# EAGLE schematic controlnode (EAGLE 6.5.0)
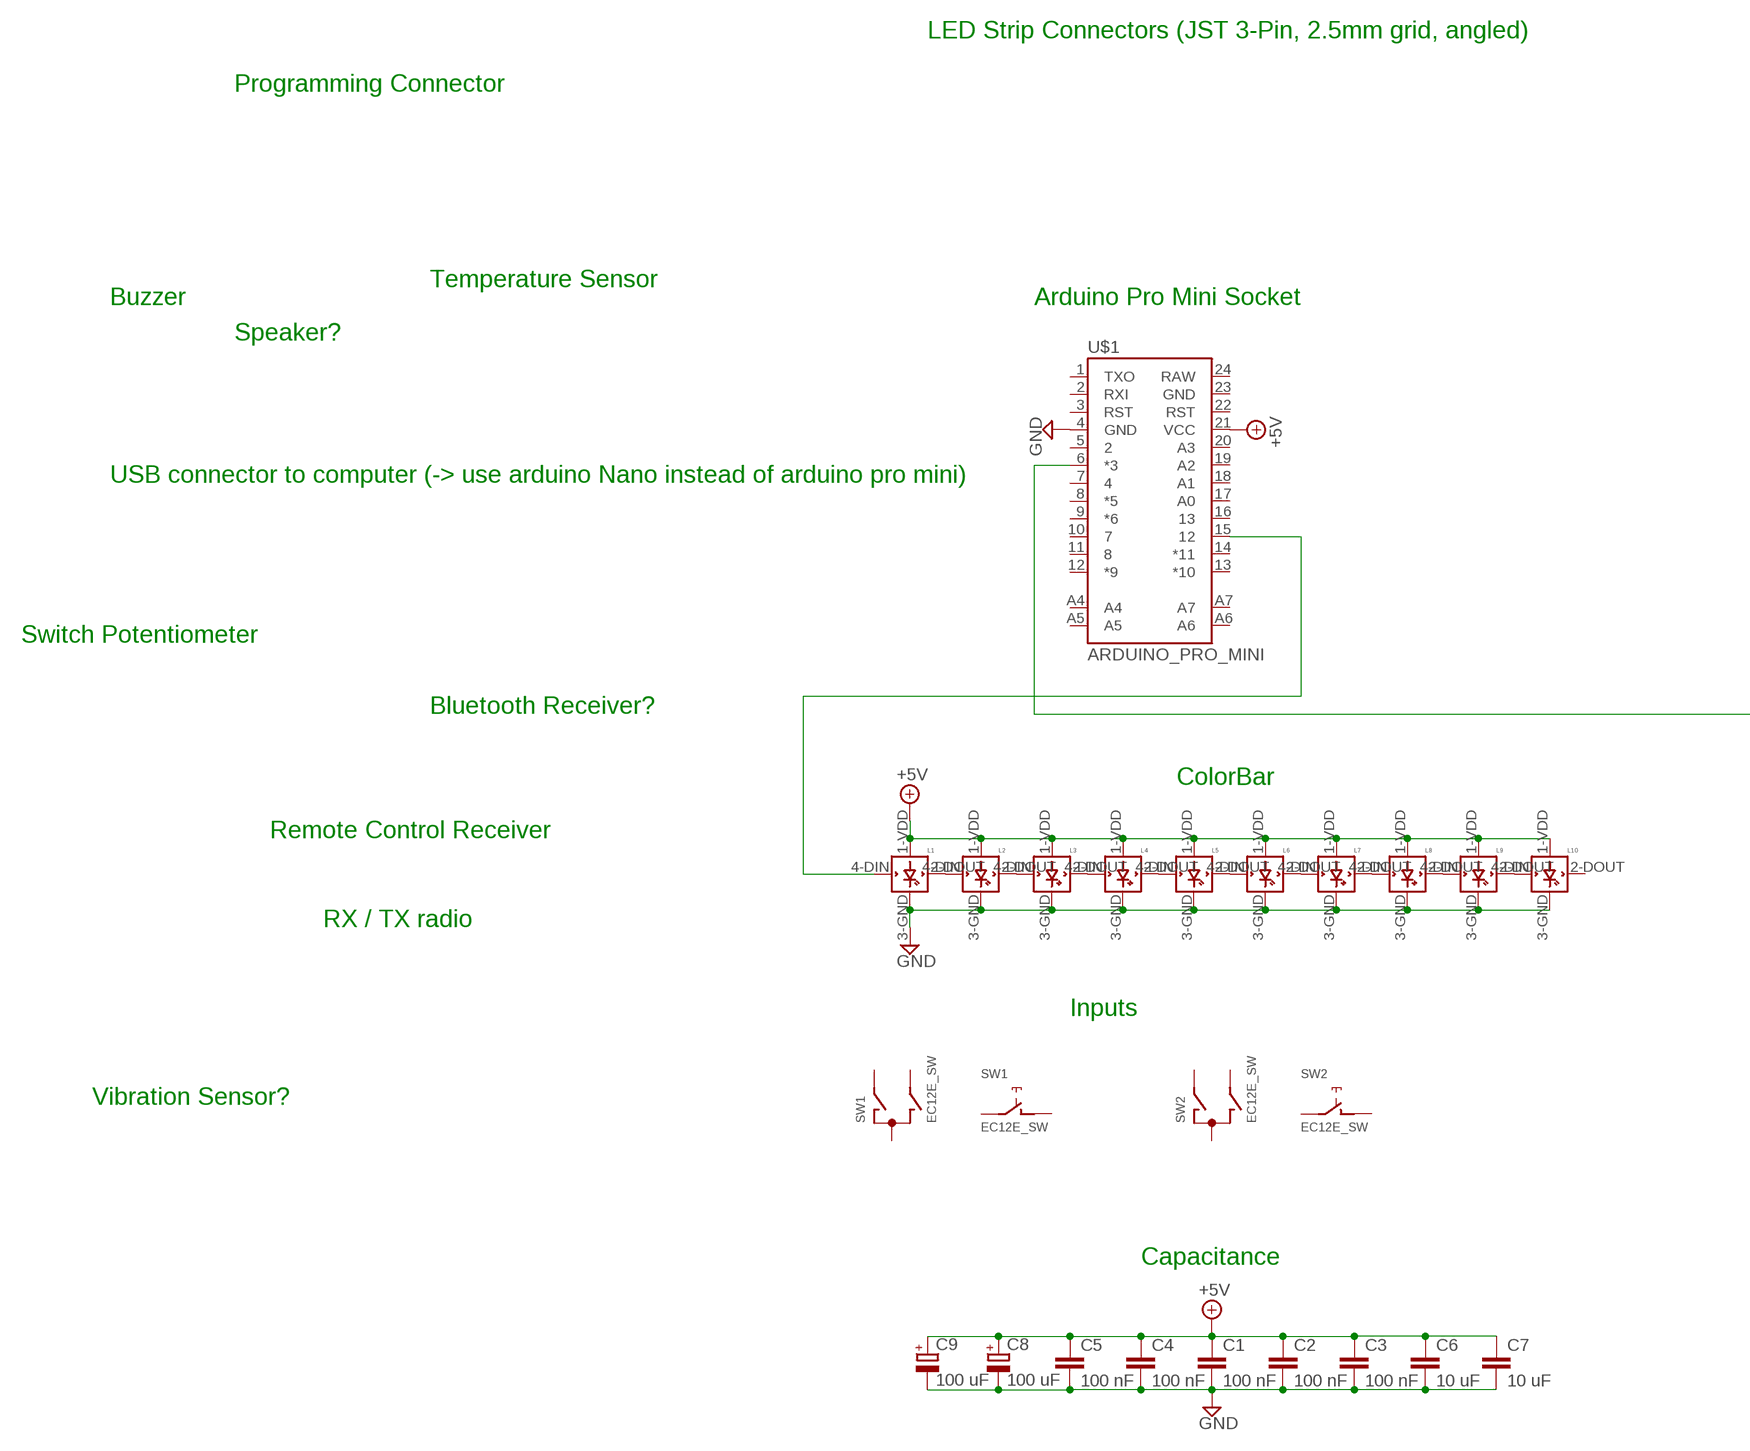
[diagram p0: schematic, sheet 1, part 1 of 2]
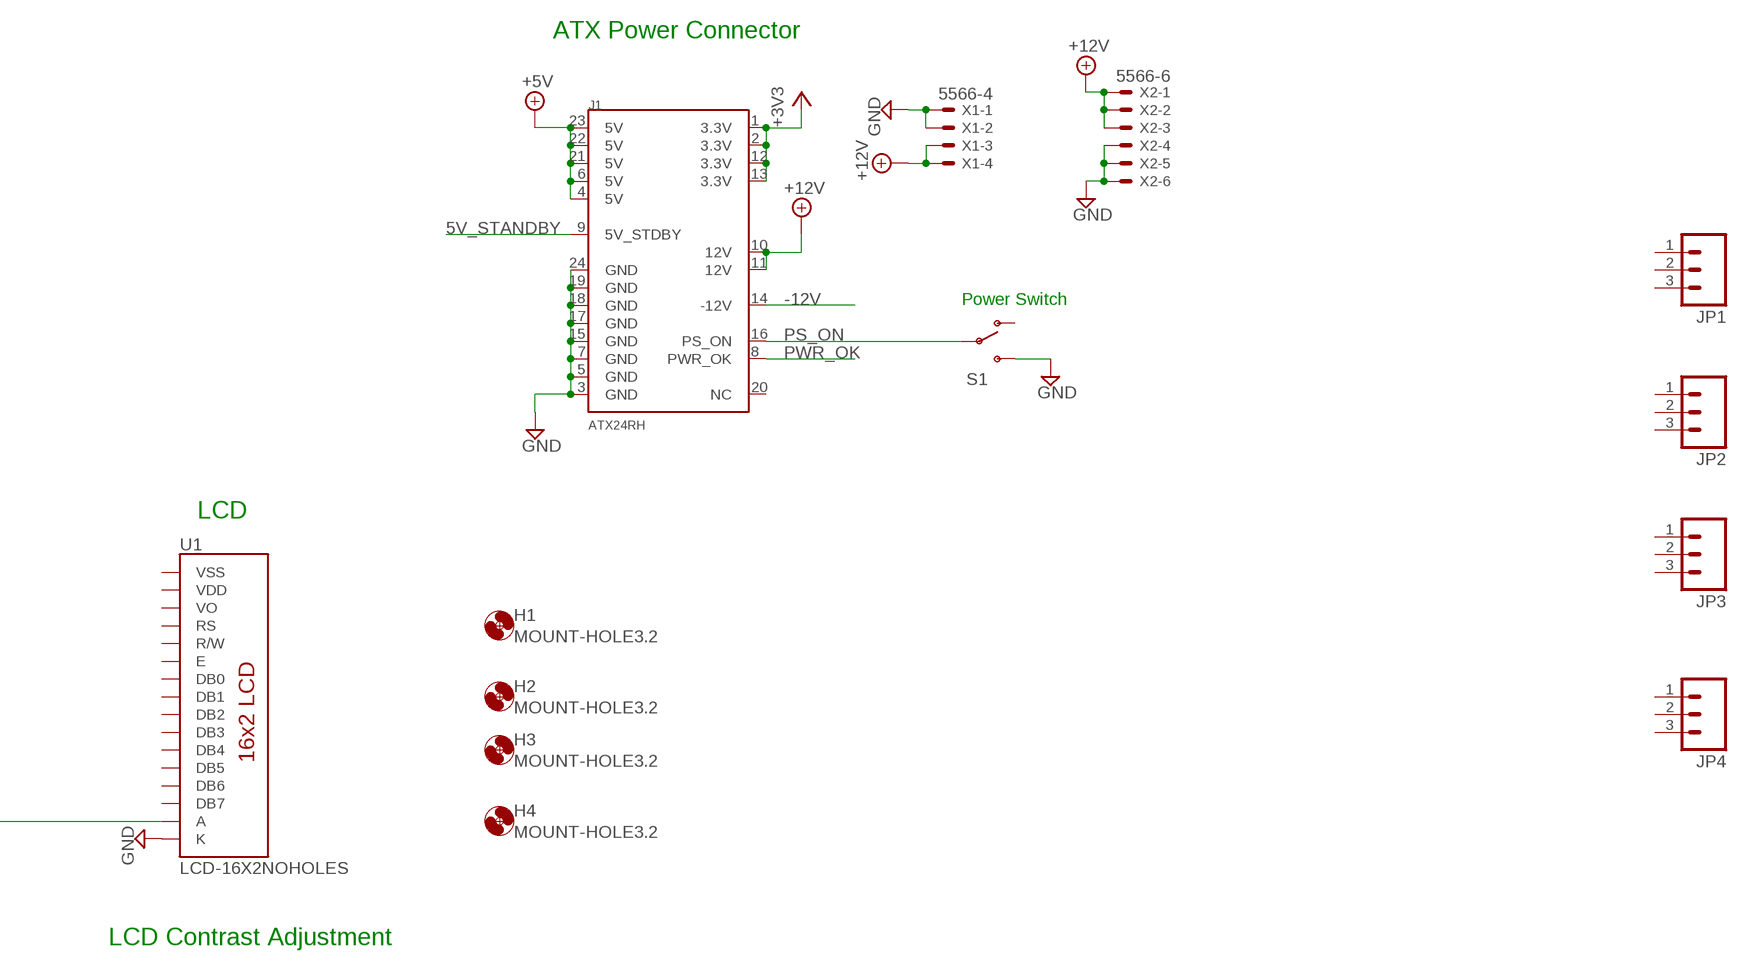
[diagram p1: schematic, sheet 1, part 2 of 2]

## Parts
C1  100 nF  C-EUC0805  [C0805]
C2  100 nF  C-EUC0805  [C0805]
C3  100 nF  C-EUC0805  [C0805]
C4  100 nF  C-EUC0805  [C0805]
C5  100 nF  C-EUC0805  [C0805]
C6  10 uF  C-EUC1206  [C1206]
C7  10 uF  C-EUC1206  [C1206]
C8  100 uF  CPOL-EUE3.5-10  [E3,5-10]
C9  100 uF  CPOL-EUE3.5-10  [E3,5-10]
H1  MOUNT-HOLE3.2  [3,2]
H2  MOUNT-HOLE3.2  [3,2]
H3  MOUNT-HOLE3.2  [3,2]
H4  MOUNT-HOLE3.2  [3,2]
J1  ATX24RH  [ATX24_RIGHT_ANGLE]
JP1  M03-SCREW-5MM  [SCREWTERMINAL-5MM-3]
JP2  M03-SCREW-5MM  [SCREWTERMINAL-5MM-3]
JP3  M03-SCREW-5MM  [SCREWTERMINAL-5MM-3]
JP4  M03-SCREW-5MM  [SCREWTERMINAL-5MM-3]
L1  WS2812B  [WS2812B]
L2  WS2812B  [WS2812B]
L3  WS2812B  [WS2812B]
L4  WS2812B  [WS2812B]
L5  WS2812B  [WS2812B]
L6  WS2812B  [WS2812B]
L7  WS2812B  [WS2812B]
L8  WS2812B  [WS2812B]
L9  WS2812B  [WS2812B]
L10  WS2812B  [WS2812B]
S1  SWITCH-SPSTPTH  [SWITCH-SPDT]
SW1  EC12E_SW  [ALPS_EC12E_SW]
SW2  EC12E_SW  [ALPS_EC12E_SW]
U1  LCD-16X2NOHOLES  [LCD-16X2_NOHOLES]
U$1  ARDUINO_PRO_MINI  [ARDUINO_PRO_MINI]
X1  5566-4  [5566-4]
X2  5566-6  [5566-6]

## Nets
5V_STANDBY: J1.9(5V_STDBY)
+3V3: J1.1(3.3V) J1.2(3.3V) J1.12(3.3V) J1.13(3.3V)
+5V: C1.1 C2.1 C3.1 C4.1 C5.1 C6.1 C7.1 C8.+ C9.+ J1.4(5V) J1.6(5V) J1.21(5V) J1.22(5V) J1.23(5V) L1.1-VDD(VDD) L2.1-VDD(VDD) L3.1-VDD(VDD) L4.1-VDD(VDD) L5.1-VDD(VDD) L6.1-VDD(VDD) L7.1-VDD(VDD) L8.1-VDD(VDD) L9.1-VDD(VDD) L10.1-VDD(VDD) U$1.21(VCC)
+12V: J1.10(12V) J1.11(12V) X1.3 X1.4 X2.1 X2.2 X2.3
-12V: J1.14(-12V)
GND: C1.2 C2.2 C3.2 C4.2 C5.2 C6.2 C7.2 C8.- C9.- J1.3(GND) J1.5(GND) J1.7(GND) J1.15(GND) J1.17(GND) J1.18(GND) J1.19(GND) J1.24(GND) L1.3-GND(GND) L2.3-GND(GND) L3.3-GND(GND) L4.3-GND(GND) L5.3-GND(GND) L6.3-GND(GND) L7.3-GND(GND) L8.3-GND(GND) L9.3-GND(GND) L10.3-GND(GND) S1.3(S) U1.16(K) U$1.4(GND) X1.1 X1.2 X2.4 X2.5 X2.6
N$1: L1.2-DOUT(DOUT) L2.4-DIN(DIN)
N$2: L2.2-DOUT(DOUT) L3.4-DIN(DIN)
N$3: L3.2-DOUT(DOUT) L4.4-DIN(DIN)
N$4: L4.2-DOUT(DOUT) L5.4-DIN(DIN)
N$5: L5.2-DOUT(DOUT) L6.4-DIN(DIN)
N$6: L6.2-DOUT(DOUT) L7.4-DIN(DIN)
N$7: L7.2-DOUT(DOUT) L8.4-DIN(DIN)
N$8: L8.2-DOUT(DOUT) L9.4-DIN(DIN)
N$9: L9.2-DOUT(DOUT) L10.4-DIN(DIN)
N$10: L1.4-DIN(DIN) U$1.15
N$20: U1.15(A) U$1.6(*3)
PS_ON: J1.16(PS_ON) S1.2(P)
PWR_OK: J1.8(PWR_OK)
Unconnected: J1.20(NC) JP1.1 JP1.2 JP1.3 JP2.1 JP2.2 JP2.3 JP3.1 JP3.2 JP3.3 JP4.1 JP4.2 JP4.3 L10.2-DOUT(DOUT) S1.1(O) SW1.A SW1.B SW1.C SW1.D SW1.E SW1.GND1(G) SW1.GND2(G) SW2.A SW2.B SW2.C SW2.D SW2.E SW2.GND1(G) SW2.GND2(G) U1.3(VO) U1.4(RS) U1.5(R/W) U1.6(E) U1.7(DB0) U1.8(DB1) U1.9(DB2) U1.10(DB3) U1.11(DB4) U1.12(DB5) U1.13(DB6) U1.14(DB7) U$1.1(TXO) U$1.2(RXI) U$1.3(RST) U$1.5 U$1.7 U$1.8(*5) U$1.9(*6) U$1.10 U$1.11 U$1.12(*9) U$1.13(*10) U$1.14(*11) U$1.16 U$1.17(A0) U$1.18(A1) U$1.19(A2) U$1.20(A3) U$1.22(RST) U$1.23(GND) U$1.24(RAW) U$1.A4 U$1.A5 U$1.A6 U$1.A7

## Notes on the sheet
- ATX Power Connector
- LED Strip Connectors (JST 3-Pin, 2.5mm grid, angled)
- Programming Connector
- Power Switch
- Temperature Sensor
- Buzzer | Arduino Pro Mini Socket
- Speaker?
- LCD
- USB connector to computer (-> use arduino Nano instead of arduino pro mini)
- Switch Potentiometer
- Bluetooth Receiver?
- ColorBar
- Remote Control Receiver | LCD Contrast Adjustment
- RX / TX radio
- Inputs
- Vibration Sensor?
- Capacitance

## Power pins joined to a net without a drawn wire
VDD: U1.2(VDD)
VSS: U1.1(VSS)

## Library data of the parts
C1-C7 = rcl:C-EU: CAPACITOR, European symbol
C8 C9 = rcl:CPOL-EU: POLARIZED CAPACITOR, European symbol
H1-H4 = holes:MOUNT-HOLE: MOUNTING HOLE with drill center marker
J1 = SparkFun-Connectors:ATX24: ATX24 Pin Power Supply Connector This is a good connector for connecting a computer power supply to a PCB. It's massive, but provides many amps of power at 5V and 12V. SKU: PRT-09498
JP1-JP4 = SparkFun-Connectors:M03: Header 3 Standard 3-pin 0.1" header. Use with straight break away headers (SKU : PRT-00116), right angle break away headers (PRT-00553), swiss pins (PRT-00743), machine pins (PRT-00117), and female headers (PRT-00115). Molex polarized connector foot print use with SKU : PRT-08232 with associated crimp pins and housings.
L1-L10 = adafruit:WS2812B
S1 = SparkFun:SWITCH-SPST: SPST Switch Simple slide switch. Spark Fun Electronics SKU : COM-00102
SW1 SW2 = switch-alps:EC12E_SW: ALPS rotary Encoder EC12E series with switch; MPN: EC12E2424407; OC_FARNELL: 1520813; OC_NEWARK: 74M1068
U1 = SparkFun:LCD-16X2
U$1 = SparkFun-Boards:ARDUINO_PRO_MINI
X1 = con-molex:5566-4: Mini FIT connector 4 pol Source: http://www.molex.com; OC_FARNELL: unknown; OC_NEWARK: unknown
X2 = con-molex:5566-6: Mini FIT connector 6 pol Source: http://www.molex.com; MPN: 95566-61002; OC_FARNELL: unknown; OC_NEWARK: 22K8620